# Altium schematic sheet power.SchDoc
size A4; SheetNumber: 1; SheetTotal: 4
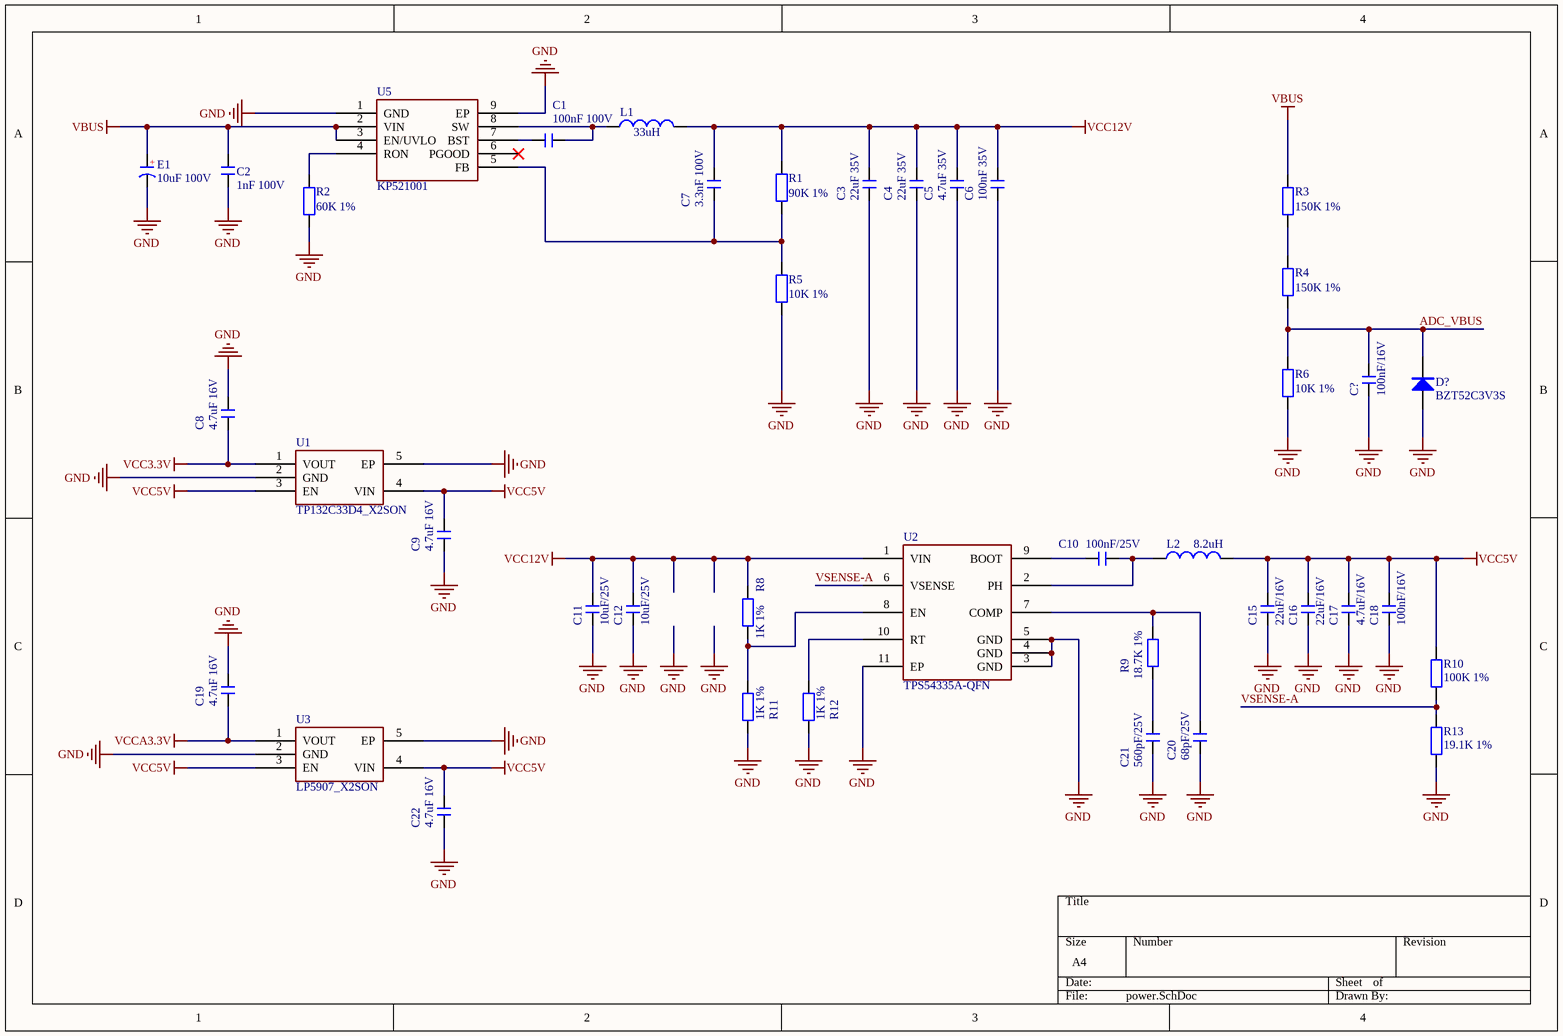
[diagram p0: power.SchDoc]

## Parts
C1  100nF 100V  [C0603_L]
C2  1nF 100V  [C0603_L]
C3  22uF 35V  [C1206_L]
C4  22uF 35V  [C1206_L]
C5  4.7uF 35V  [C0603_L]
C6  100nF 35V  [C0603_L]
C7  3.3nF 100V  [C0603_L]
C8  4.7uF 16V  [C0603_L]
C9  4.7uF 16V  [C0603_L]
C10  100nF/25V  [c0603_l]
C11  10uF/25V  [C1206_L]
C12  10uF/25V  [C1206_L]
C15  22uF/16V  [C1206_l]
C16  22uF/16V  [C1206_l]
C17  4.7uF/16V  [c0603_l]
C18  100nF/16V  [c0603_l]
C19  4.7uF 16V  [C0603_L]
C20  68pF/25V  [c0603_l]
C21  560pF/25V  [c0603_l]
C22  4.7uF 16V  [C0603_L]
C?  100nF/16V  [c0603_l]
D?  BZT52C3V3S  [SOD-323]
E1  10uF 100V  [CT 6*4 - V]
L1  33uH  [NR6028]
L2  8.2uH  [NR4020]
R1  90K 1%  [R0603_l]
R2  60K 1%  [R0603_l]
R3  150K 1%  [R0603_l]
R4  150K 1%  [R0603_l]
R5  10K 1%  [R0603_l]
R6  10K 1%  [R0603_l]
R8  1K 1%  [R0603_l]
R9  18.7K 1%  [R0603_l]
R10  100K 1%  [R0603_l]
R11  1K 1%  [R0603_l]
R12  1K 1%  [R0603_l]
R13  19.1K 1%  [R0603_l]
U1  TP132C33D4_X2SON  [ZQFN-4L_L1.0-W1.0-P0.63-BL-EP]
U2  TPS54335A-QFN  [VSON-10_L3.0-W3.0-P0.50-TL-EP]
U3  LP5907_X2SON  [ZQFN-4L_L1.0-W1.0-P0.63-BL-EP]
U5  KP521001  [ESOP8_N]

## Nets
GND: C2.1 C3.1 C4.1 C5.1 C6.1 C8.2 C9.1 C11.1 C12.1 C15.1 C16.1 C17.1 C18.1 C19.2 C20.1 C21.1 C22.1 C?.1 D?.1(A) E1.2(K) R2.2 R5.2 R6.2 R11.2 R12.2 R13.2 U1.2(GND) U1.5(EP) U2.3(GND) U2.4(GND) U2.5(GND) U2.11(EP) U3.2(GND) U3.5(EP) U5.1(GND) U5.9(EP)
VBUS: C2.2 E1.1(A) R3.1 U5.2(VIN) U5.3(EN/UVLO)
VCC3.3V: C8.1 U1.1(VOUT)
VCC5V: C9.2 C15.2 C16.2 C17.2 C18.2 C22.2 L2.2 R10.1 U1.3(EN) U1.4(VIN) U3.3(EN) U3.4(VIN)
VCC12V: C3.2 C4.2 C5.2 C6.2 C7.2 C11.2 C12.2 L1.2 R1.1 R8.1 U2.1(VIN)
VCCA3.3V: C19.1 U3.1(VOUT)
ADC_VBUS: C?.2 D?.2(K) R4.2 R6.1
VSENSE-A: R10.2 R13.1 U2.6(VSENSE)
NetC1_1: C1.1 L1.1 U5.8(SW)
NetC1_2: C1.2 U5.7(BST)
NetC7_1: C7.1 R1.2 R5.1 U5.5(FB)
NetC10_1: C10.1 L2.1 U2.2(PH)
NetC10_2: C10.2 U2.9(BOOT)
NetC20_2: C20.2 R9.1 U2.7(COMP)
NetC21_2: C21.2 R9.2
NetR2_1: R2.1 U5.4(RON)
NetR3_2: R3.2 R4.1
NetR8_2: R8.2 R11.1 U2.8(EN)
NetR12_1: R12.1 U2.10(RT)

Not connected (* = marked no-connect by the designer): U5 6(PGOOD)*

## Notes on the sheet
- (in symbol C-CD) +

## Library data of the parts
C1-C9 C19 C22 = C-MLCC: 独石电容; 版权归属: 源创客; BOM名称: 独石电容; 学习资源: www.ooocke.com
C10-C12 C15-C18 C20 C21 C? = C: 无极性贴片电容; 版权归属: 源创客; 材质: X7R; BOM名称: 无极性贴片电容; 学习资源: www.ooocke.com
D? = 1N4148: 高速开关二极管; 版权归属: 源创客; BOM名称: 高速开关二极管; 学习资源: www.ooocke.com
E1 = C-CD: 贴片钽电容; 版权归属: 源创客; BOM名称: 贴片钽电容; 学习资源: www.ooocke.com
L1 L2 = L: 小功率贴片电感; 版权归属: 源创客; BOM名称: 小功率贴片电感; 学习资源: www.ooocke.com
R1-R6 R8-R13 = R: 贴片电阻; 版权归属: 源创客; BOM名称: 贴片电阻; 学习资源: www.ooocke.com
U1 = TP132C33D4_X2SON: 与SOT-23-5符号不同！！！！！
U2 = TPS54335A-QFN: BUCK
U3 = LP5907_X2SON: 与SOT-23-5符号不同！！！！！
U5 = KP521001: DCDC降压芯片 最大电压100V 最大电流1A